# Altium schematic sheet rev02_12.SchDoc
size 409 x 282 mm
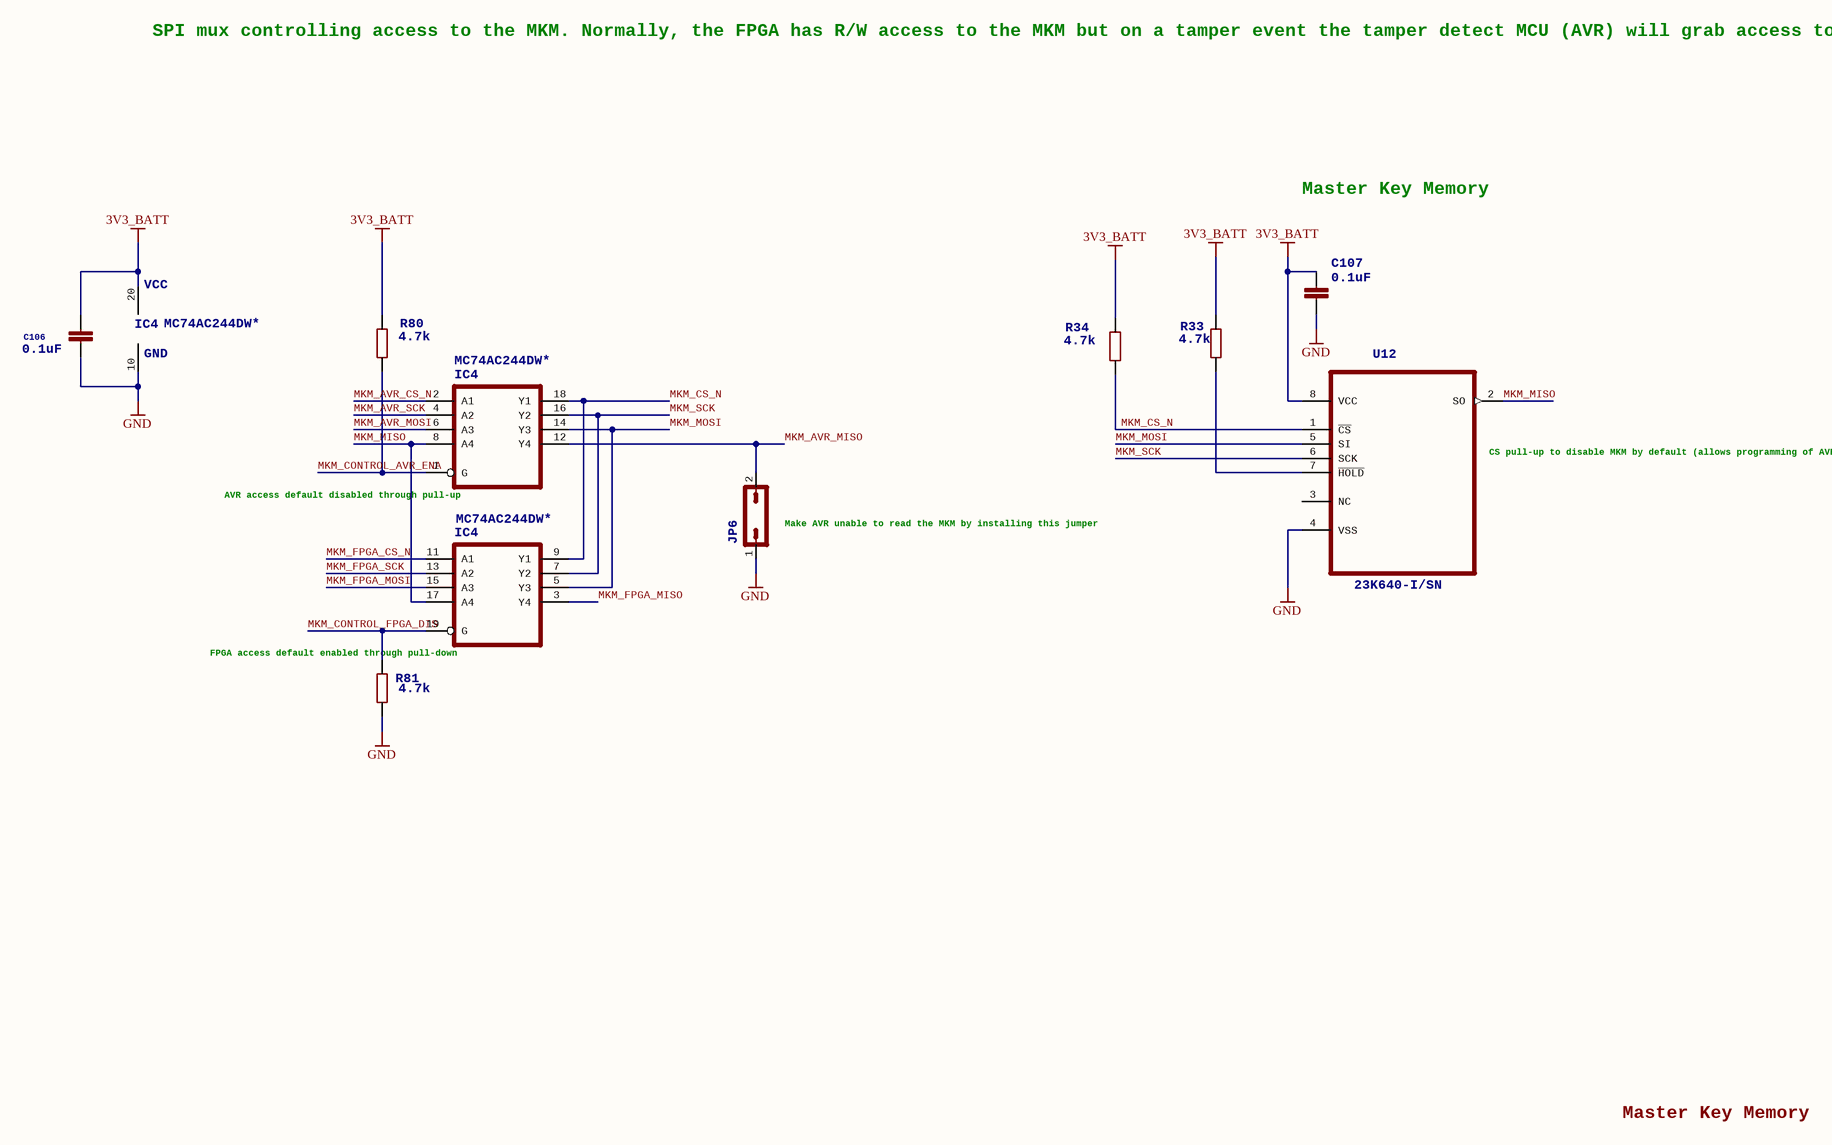
[diagram p0: rev02_12.SchDoc]

## Parts
C106  value 0.1uF  [C_0402]
C107  value 0.1uF  [C_0402]
IC4  MC74AC244DW*  >NAME: IC4  [SO20W]  (parts A,B,C of 3)
JP6  >NAME: JP6  [PLS-2]  (hidden comment: 61300211121)
R33  value 4.7k  [R_0402]
R34  value 4.7k  [R_0402]
R80  value 4.7k  >NAME: R80  [R_0402]
R81  value 4.7k  >NAME: R81  [R_0402]
U12  >NAME: U12  [SOIC127P600X175-8N]  (hidden comment: 23K640-I/SN)

## Nets
3V3_BATT: C106.1 C107.1 IC4.20(VCC) R33.1 R34.2 R80.2 U12.8(VCC)
GND: C106.2 C107.2 IC4.10(GND) JP6.1 R81.2 U12.4(VSS)
MKM_AVR_CS_N: IC4.2(A1)
MKM_AVR_MISO: IC4.12(Y4) JP6.2
MKM_AVR_MOSI: IC4.6(A3)
MKM_AVR_SCK: IC4.4(A2)
MKM_CONTROL_AVR_ENA: IC4.1(G) R80.1
MKM_CONTROL_FPGA_DIS: IC4.19(G) R81.1
MKM_CS_N: IC4.9(Y1) IC4.18(Y1) R34.1 U12.1(~{CS})
MKM_FPGA_CS_N: IC4.11(A1)
MKM_FPGA_MISO: IC4.3(Y4)
MKM_FPGA_MOSI: IC4.15(A3)
MKM_FPGA_SCK: IC4.13(A2)
MKM_MISO: IC4.8(A4) IC4.17(A4) U12.2(SO)
MKM_MOSI: IC4.5(Y3) IC4.14(Y3) U12.5(SI)
MKM_SCK: IC4.7(Y2) IC4.16(Y2) U12.6(SCK)
NetR33_2: R33.2 U12.7(~{HOLD})

Not connected (* = marked no-connect by the designer): U12 3(NC)

## Notes on the sheet
- SPI mux controlling access to the MKM.
  Normally, the FPGA has R/W access to the MKM but on a
  tamper event the tamper detect MCU (AVR) will grab access
  to the MKM and erase the contents.
- Master Key Memory
- (near U12) CS pull-up to disable MKM by
  default (allows programming
  of AVR)
- (near IC4) AVR access default
  disabled through pull-up
- (near JP6) Make AVR unable to read the
  MKM by installing this jumper
- (near R81) FPGA access default
  enabled through pull-down

## Library data of the parts
C106 C107 = C-EUC0402: 0402 CAPACITOR
IC4 = 74*244DW: Octal BUFFER and LINE DRIVER, 3-state; >VALUE: 74*244DW
JP6 = JP1Q: Wurth 2pins connector (for jumper); >VALUE: JP1Q
R33 R34 R80 R81 = R-EU_R0402: 0402 Resistor 5%
  R80 R81: TOLERANCE: 5%
U12 = 23K640-I/SN: 64K SPI Bus Low-Power Serial SRAM,SOIC-8; MPN: 23K640-I/SN; OC_FARNELL: 1695549; OC_NEWARK: 71P4706; PACKAGE: SOIC-8; SUPPLIER: MICROCHIP; >VALUE: 23K640-I/SN